# EAGLE schematic Proto1 (EAGLE 7.1.0)
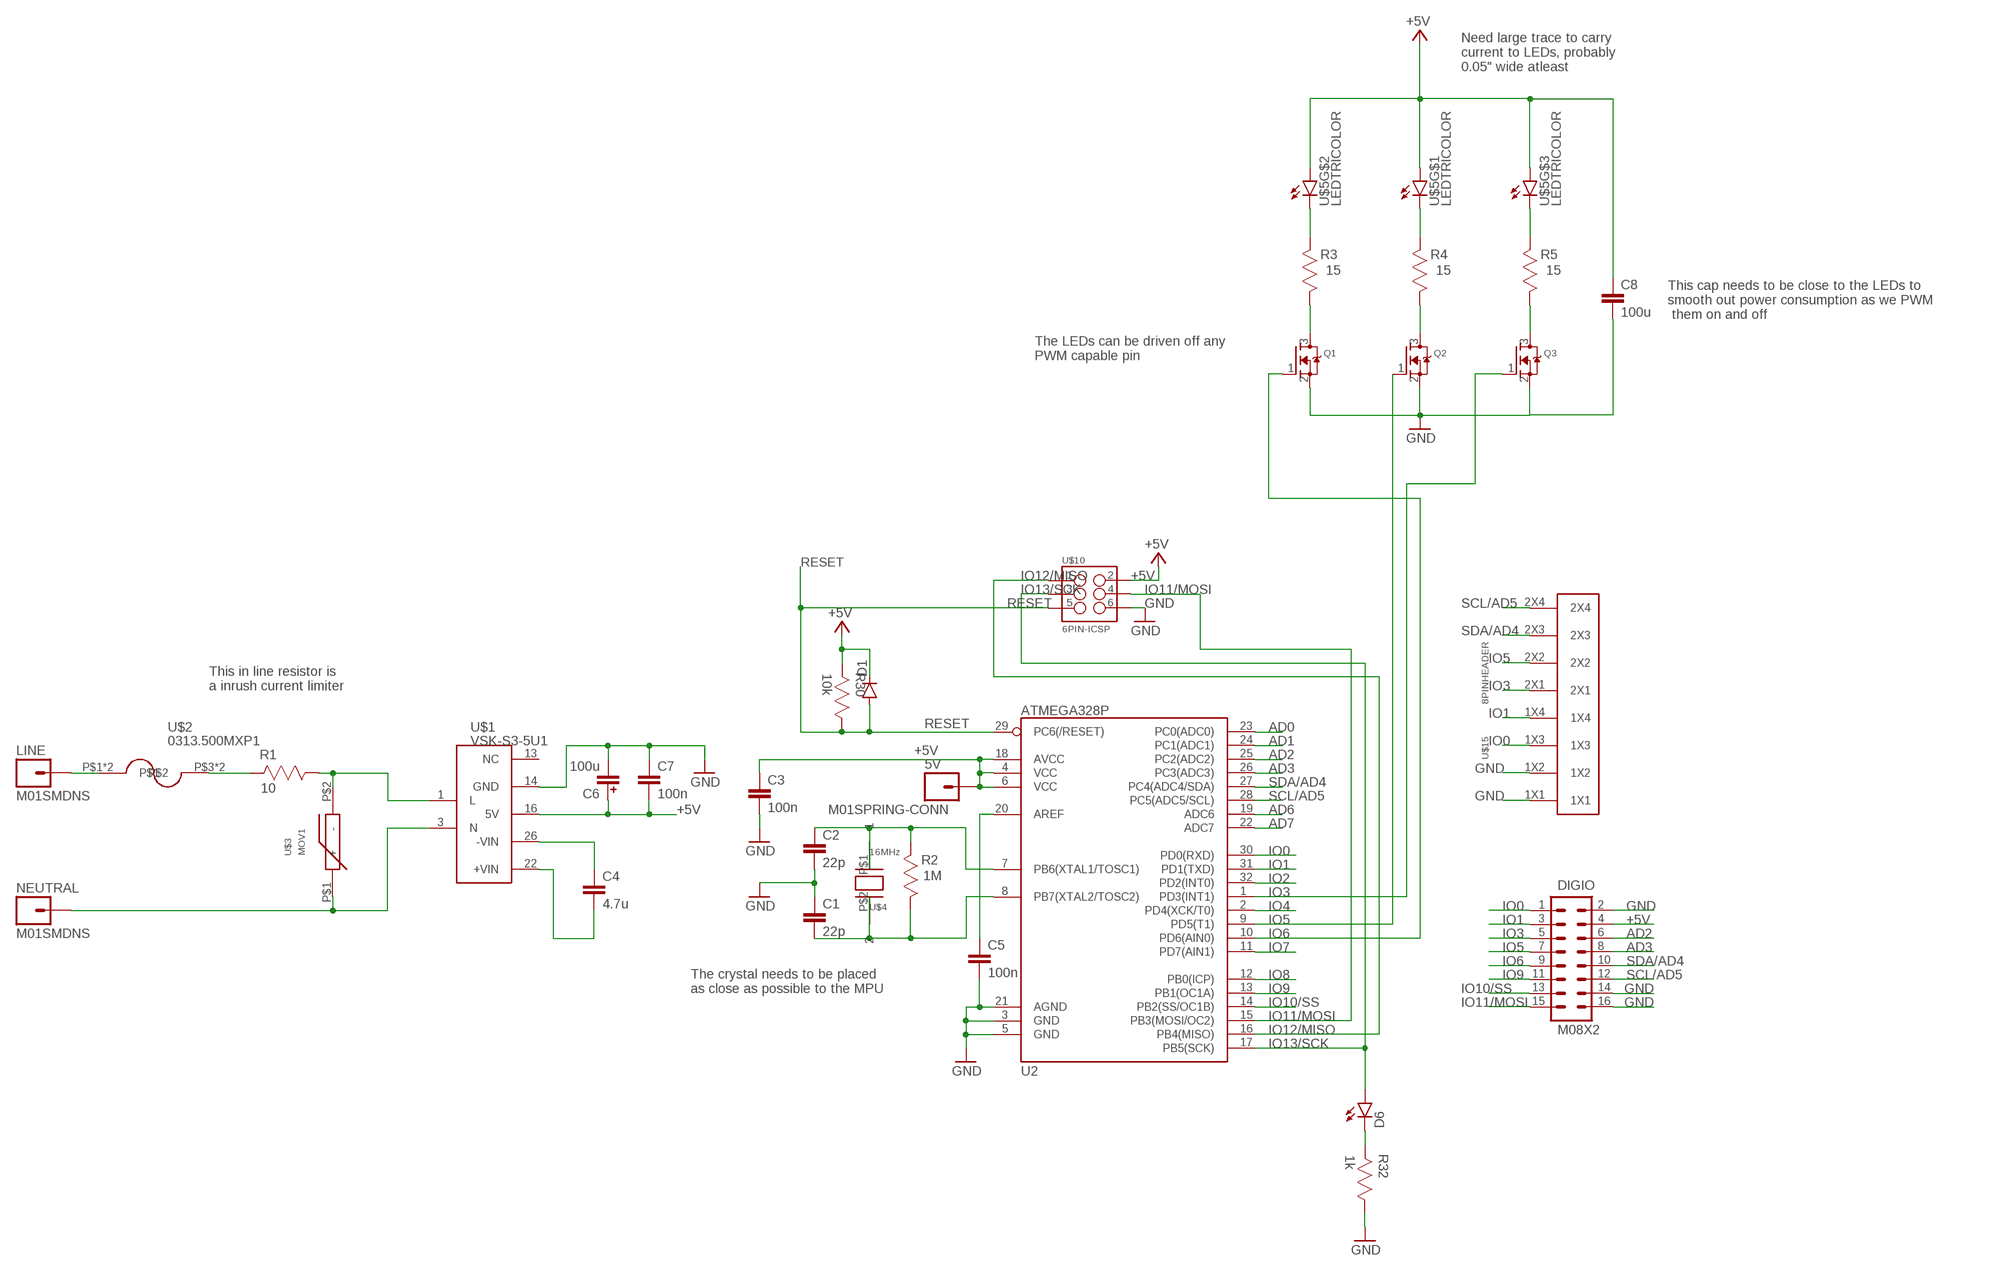
[diagram p0: schematic, sheet 1]

## Parts
5V  M01SPRING-CONN  [SPRING-CONNECTOR]
C1  22p  CAP0603-CAP  [0603-CAP]
C2  22p  CAP0603-CAP  [0603-CAP]
C3  100n  CAP0603-CAP  [0603-CAP]
C4  4.7u  CAP0603-CAP  [0603-CAP]
C5  100n  CAP0603-CAP  [0603-CAP]
C6  100u  SMDCAP1  [WXSERIES-SMDCAP]
C7  100n  CAP0603-CAP  [0603-CAP]
C8  100u  CAP0603-CAP  [0603-CAP]
D1  DIODE1N4148  [DIODE-1N4148]
D6  LED-YELLOW0603  [LED-0603]
DIGIO  M08X2  [2X8]
LINE  M01SMDNS  [1X01NS]
NEUTRAL  M01SMDNS  [1X01NS]
Q1  MOSFET-NREFLOW  [SOT23]
Q2  MOSFET-NREFLOW  [SOT23]
Q3  MOSFET-NREFLOW  [SOT23]
R1  10  0603RESISTOR1  [0603RESISTOR]
R2  1M  0603RESISTOR1  [0603RESISTOR]
R3  15  0603RESISTOR1  [0603RESISTOR]
R4  15  0603RESISTOR1  [0603RESISTOR]
R5  15  0603RESISTOR1  [0603RESISTOR]
R30  10k  0603RESISTOR1  [0603RESISTOR]
R32  1k  0603RESISTOR1  [0603RESISTOR]
U2  ATMEGA328P  ATMEGA328_SMT  [TQFP32-08]
U$1  VSK-S3-5U1  [VSK-S3-DCAC]
U$2  0313.500MXP1  [FUSEHOLDER0.25IN]
U$3  MOV1  [MOV]
U$4  16MHz  SMDCRYSTAL  [SMDCRYSTAL]
U$5  LEDTRICOLOR  [TRICOLORLED]
U$10  6PIN-ICSP  [2X3-ICSP]
U$15  8PINHEADER  [HEADERSMDRIGHTANGLE4X2]

## Nets
+5V [usbvcc]: 5V.P$2 C3.1 C6.POS C7.2 C8.1 D1.C DIGIO.4 R30.2 U2.4(VCC) U2.6(VCC) U2.18(AVCC) U$1.16(5V) U$5.A1(A) U$5.A2(A) U$5.A3(A) U$10.2(+5V)
AD0: U2.23(PC0(ADC0))
AD1: U2.24(PC1(ADC1))
AD2: DIGIO.6 U2.25(PC2(ADC2))
AD3: DIGIO.8 U2.26(PC3(ADC3))
AD6: U2.19(ADC6)
AD7: U2.22(ADC7)
GND [gnd]: C1.1 C2.2 C3.2 C5.2 C6.NEG C7.1 C8.2 DIGIO.2 DIGIO.14 DIGIO.16 Q1.2(S) Q2.2(S) Q3.2(S) R32.1 U2.3(GND) U2.5(GND) U2.21(AGND) U$1.14(GND) U$10.6(GND) U$15.1X1 U$15.1X2
IO0: DIGIO.1 U2.30(PD0(RXD)) U$15.1X3
IO1: DIGIO.3 U2.31(PD1(TXD)) U$15.1X4
IO2: U2.32(PD2(INT0))
IO3: DIGIO.5 Q3.1(G) U2.1(PD3(INT1)) U$15.2X1
IO4: U2.2(PD4(XCK/T0))
IO5: DIGIO.7 Q2.1(G) U2.9(PD5(T1)) U$15.2X2
IO6: DIGIO.9 Q1.1(G) U2.10(PD6(AIN0))
IO7: U2.11(PD7(AIN1))
IO8: U2.12(PB0(ICP))
IO9: DIGIO.11 U2.13(PB1(OC1A))
IO10/SS: DIGIO.13 U2.14(PB2(SS/OC1B))
IO11/MOSI: DIGIO.15 U2.15(PB3(MOSI/OC2)) U$10.4(MOSI)
IO12/MISO: U2.16(PB4(MISO)) U$10.1(MISO)
IO13/SCK: D6.A U2.17(PB5(SCK)) U$10.3(SCK)
N$1: R1.1 U$1.1(L) U$3.P$2(-)
N$2: NEUTRAL.1 U$1.3(N) U$3.P$1(+)
N$3: C4.1 U$1.26(-VIN)
N$4: C4.2 U$1.22(+VIN)
N$5: D6.C R32.2
N$6: C1.2 R2.1 U2.8(PB7(XTAL2/TOSC2)) U$4.P$2
N$7: LINE.1 U$2.P$1 U$2.P$2
N$8: R1.2 U$2.P$3 U$2.P$4
N$9: C2.1 R2.2 U2.7(PB6(XTAL1/TOSC1)) U$4.P$1
N$11: C5.1 U2.20(AREF)
N$12: Q1.3(D) R3.1
N$13: Q2.3(D) R4.1
N$14: Q3.3(D) R5.1
N$15: R3.2 U$5.C2(C)
N$16: R4.2 U$5.C1(C)
N$17: R5.2 U$5.C3(C)
RESET: D1.A R30.1 U2.29(PC6(/RESET)) U$10.5(RESET)
SCL/AD5: DIGIO.12 U2.28(PC5(ADC5/SCL)) U$15.2X4
SDA/AD4: DIGIO.10 U2.27(PC4(ADC4/SDA)) U$15.2X3
Unconnected: U$1.13(NC)

## Notes on the sheet
- Need large trace to carry
  current to LEDs, probably
  0.05" wide atleast
- This cap needs to be close to the LEDs to 
  smooth out power consumption as we PWM
   them on and off
- The LEDs can be driven off any
  PWM capable pin
- This in line resistor is 
  a inrush current limiter
- The crystal needs to be placed
  as close as possible to the MPU

## Library data of the parts
5V LINE NEUTRAL = CharlieCreations:M01: Header 1 Standard 1-pin 0.1" header. Use with straight break away headers (SKU : PRT-00116), right angle break away headers (PRT-00553), swiss pins (PRT-00743), machine pins (PRT-00117), and female headers (PRT-00115).
C1-C5 C7 C8 = CharlieCreations:CAP: Capacitor Standard 0603 ceramic capacitor, and 0.1" leaded capacitor.
C6 = CharlieCreations:SMDCAP
D1 = CharlieCreations:DIODE: Diode These are standard reverse protection diodes and small signal diodes. SMA package can handle up to about 1A. SOD-323 can handle about 200mA. What the SOD-323 package when ordering, there are some mfgs out there that are 5-pin packages.
D6 = CharlieCreations:LED-YELLOW: Yellow SMD LEDs LilyPad 1206- DIO-09909 0603- DIO-09003; PROD_ID: DIO-09003
DIGIO = CharlieCreations:M08X2: .1" headers, two rows of 8 each
Q1-Q3 = CharlieCreations:MOSFET-N: N-Channel Mosfet 2N7002E - 60V 260mA SOT23 [Digikey: 2N7002ET1GOSTR-ND] - REEL BSH103 - 30V 850mA SOT23 [Digikey: 568-5013-1-ND]
R1-R5 R30 R32 = CharlieCreations:0603RESISTOR: RESISTOR, 0603; MPN: CRCW06031K21FKEA; OC_FARNELL: 1652852; OC_NEWARK: 52K8027; SUPPLIER: Vishay; TOLERANCE: ± 1.0 %; VALUE: 0; WATTAGE: 0.1W
U2 = CharlieCreations:ATMEGA328_SMT: 32-Pin Atmega328 part Commonly used on Arduino compatible boards Available in QFP and QFN packages TQFP is IC-09069 QFN is non-stock; PROD_ID: IC-09069
U$1 = CharlieCreations:VSK-S3-5U: Universal AC to DC adapter, 5V Output, Manufacturer: CUI Inc
U$2 = CharlieCreations:0313.500MXP: 500mA Fuse by LittleFuse INC
U$3 = CharlieCreations:MOV
U$4 = CharlieCreations:SMDCRYSTAL
U$5 = CharlieCreations:LEDTRICOLOR
U$10 = CharlieCreations:6PIN-ICSP
U$15 = CharlieCreations:8PINHEADER

## Net classes
0 default: width 0.254 mm, clearance 0.254 mm
1 power: width 0.61 mm, drill 0.61 mm, clearance 0.254 mm
2 gnd: width 0.305 mm, drill 0.559 mm, clearance 0.254 mm
3 usbvcc: width 0.508 mm, drill 0.61 mm, clearance 0.254 mm
4 aref: width 0.406 mm, drill 0.61 mm, clearance 0.254 mm